# Altium schematic sheet StromsensorTP.SchDoc
size A4; SheetNumber: 3; SheetTotal: 7
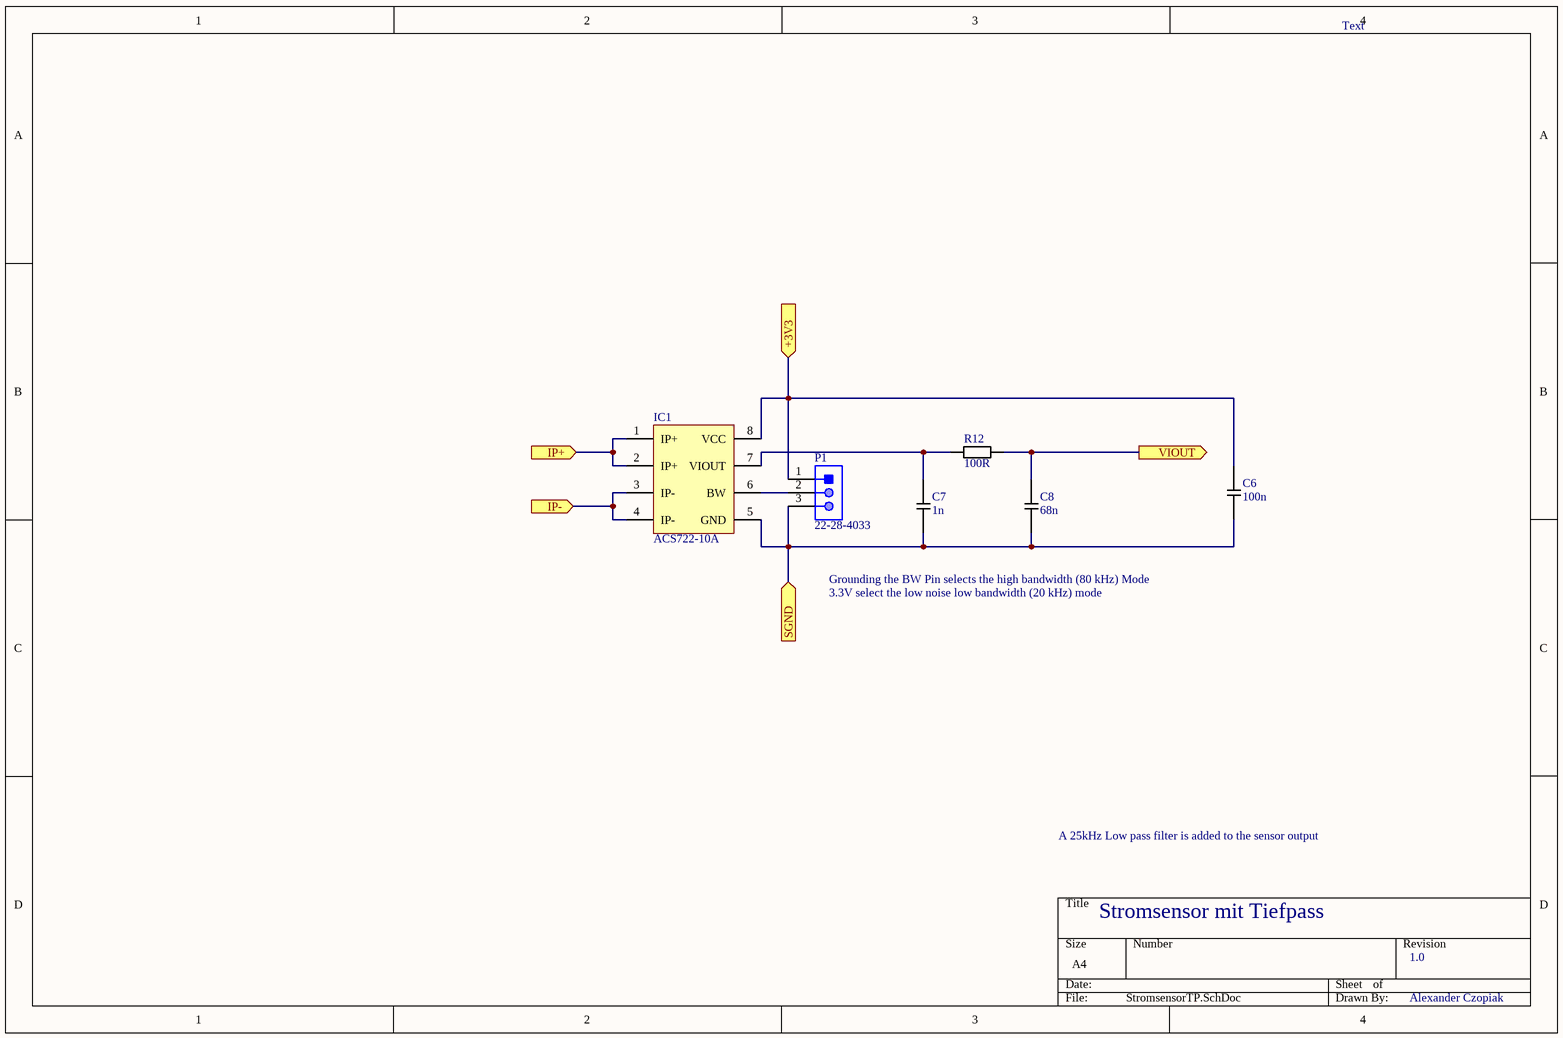
[diagram p0: StromsensorTP.SchDoc]

## Parts
C6  100n  [1206_C]
C7  1n  [1206_C]
C8  68n  [1206_C]
IC1  ACS722-10A  [SO08_N]
P1  22-28-4033  [MOLX-22-28-4033_V]
R12  100R  [1206_R]

## Ports
+3V3 (in, see Halbbruecke[4B], Gatetreiber[1B], Halbbruecke[2B], Hochsetzsteller[2A], SpannungssensorTP[4B]), IP+ (in, see Halbbruecke[4B]), IP- (in, see Halbbruecke[4B]), SGND (in, see Halbbruecke[4C], Gatetreiber[1D], Halbbruecke[2D], Hochsetzsteller[3D], SpannungssensorTP[3C]), VIOUT (out, see Halbbruecke[4C])

## Nets
+3V3: C6.2 IC1.8(VCC) P1.1 ; port +3V3
IP+: IC1.1(IP+) IC1.2(IP+) ; port IP+
IP-: IC1.3(IP-) IC1.4(IP-) ; port IP-
SGND: C6.1 C7.1 C8.1 IC1.5(GND) P1.3 ; port SGND
VIOUT: C8.2 R12.2 ; port VIOUT
NetC7_2: C7.2 IC1.7(VIOUT) R12.1
NetIC1_6: IC1.6(BW) P1.2

## Notes on the sheet
- Text
- Grounding the BW Pin selects the high bandwidth (80 kHz) Mode
- 3.3V select the low noise low bandwidth (20 kHz) mode
- A 25kHz Low pass filter is added to the sensor output
- Stromsensor mit Tiefpass
- 1.0
- Alexander Czopiak

## Library data of the parts
C6-C8 = CAP: Kondensator (ohne Polarität)
IC1 = Current Sensor ACS722: ComponentLink1Description: Datasheet; ComponentLink1URL: https://ebs.eti.kit.edu/files/ebs_uploads/20170616-1458_Datenblatt_ACS722LLCTR-10AB-T.pdf
P1 = CMP-1676-00001-5: Stiftleiste 3 fach, Male Header, Pitch 2.54 mm, 1 x 3 Position, Height 8.38 mm, Tail Length 3.18 mm, RoHS, Bulk; Manufacturer: Molex; Rows: 1; Voltage Rating: 250 V; Current Rating: 4 A; Min Operating Temperature: 0 degC; Lead Pitch: 0.1 inch; Packaging: Bulk; Contact Finish: Gold; RoHSCompliant: true; Contact Material: Brass; PackageReference: 22-28-4033; REACH SVHC: Unknown; PackageDescription: Male Header, Pitch 2.54 mm, 1 x 3 Position, Height 8.38 mm, Tail Length 3.18 mm; ComponentLink2URL: http://www.molex.com/pdm_docs/sd/022284033_sd.pdf; Height: 8.38 mm; Mounting Technology: Through Hole; ComponentLink1Description: Manufacturer URL; Length: 7.62 mm; Mount: Through Hole; DatasheetVersion: Rev. G, 01/2012; Max Operating Temperature: 75 degC; ComponentLink2Description: Datasheet; Colour: Black; Pins: 3; Contact Plating: Gold; Package Quantity: 1; ComponentLink1URL: http://www.molex.com/
R12 = WIDERSTAND